# EAGLE schematic PM_sensor_breakout_v1 (EAGLE 6.4)
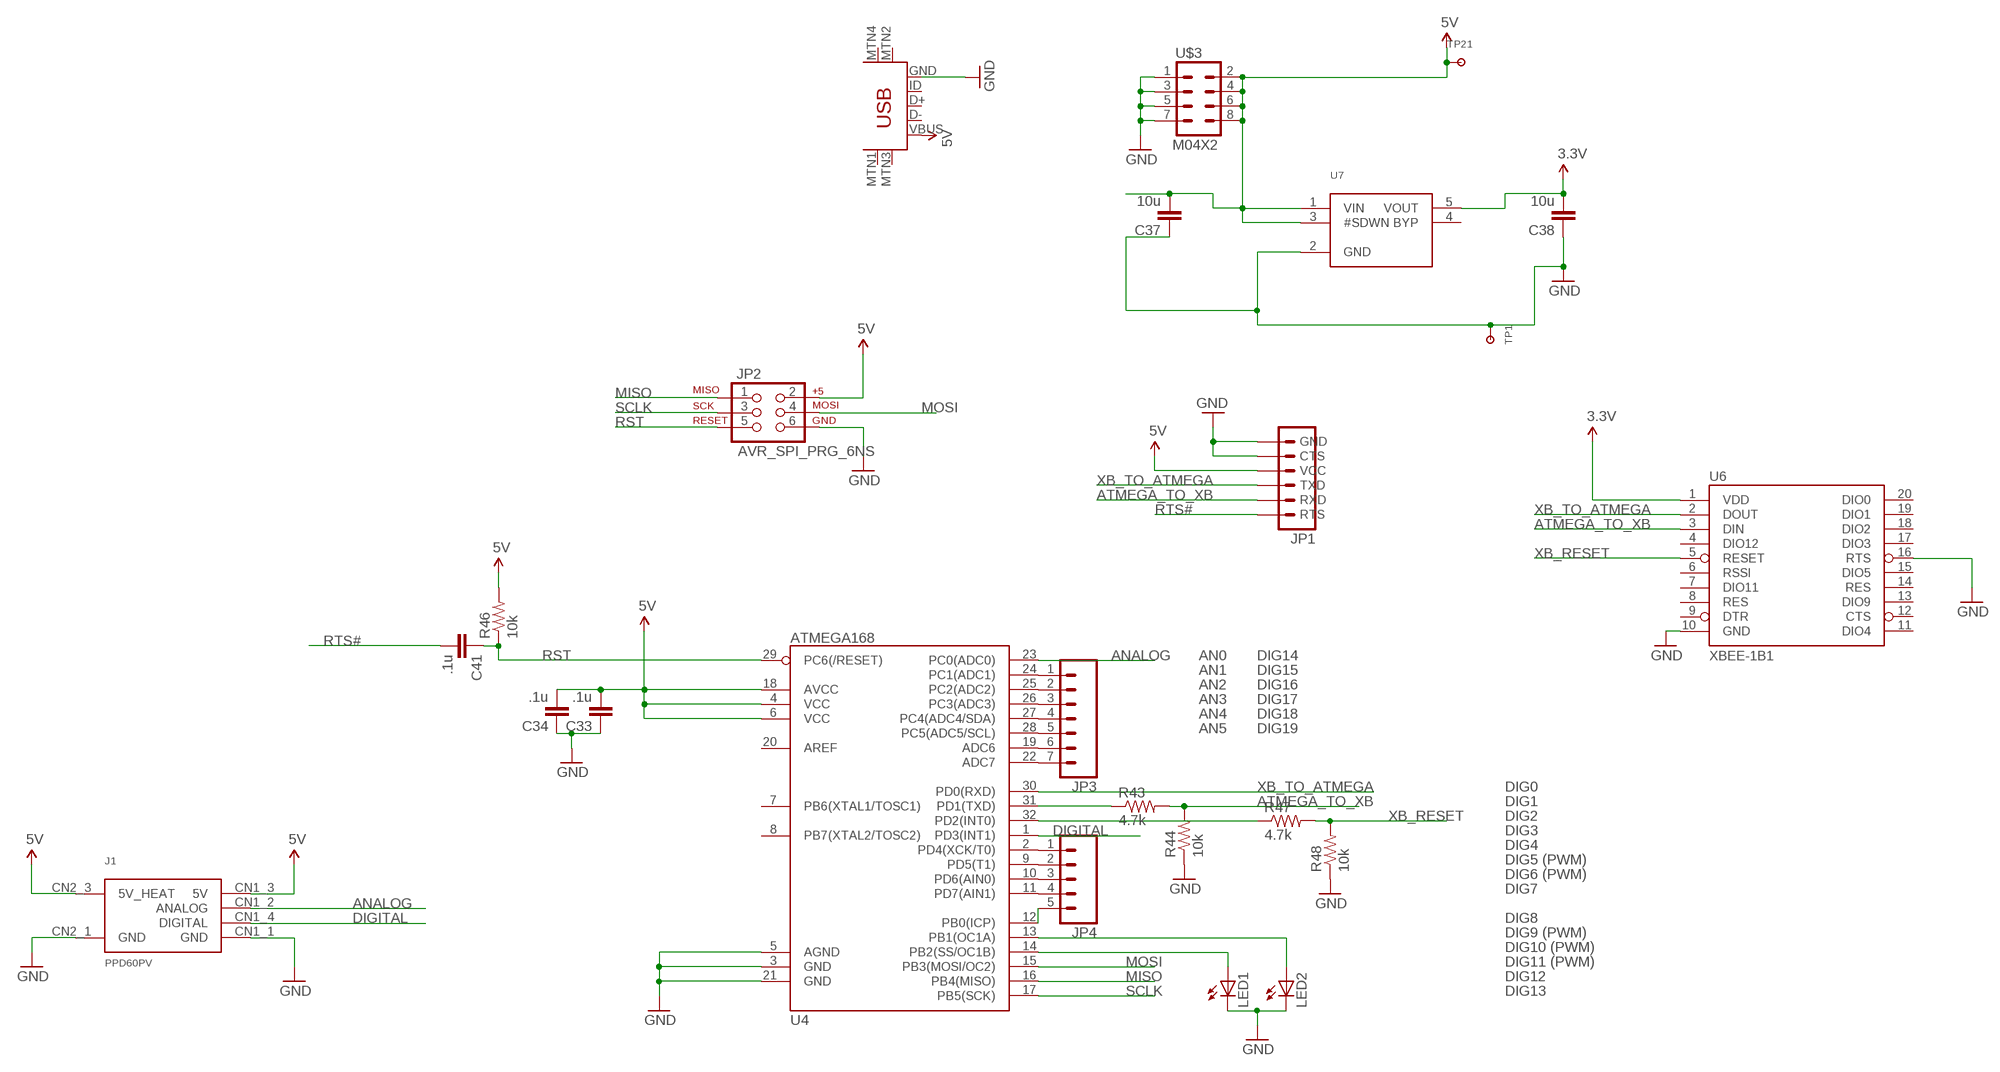
[diagram p0: schematic, sheet 1]

## Parts
C33  .1u  CAP0603  [0603]
C34  .1u  CAP0603  [0603]
C37  10u  CAP0603  [0603]
C38  10u  CAP0603  [0603]
C41  .1u  CAP0603  [0603]
J1  PPD60PV  [PPD60PV]
JP1  FTDI_CABLESIP  [1X06]
JP2  AVR_SPI_PRG_6NS  [2X3-NS]
JP3  M07  [1X07]
JP4  M05PTH  [1X05]
LED1  LEDCHIPLED_0805  [CHIPLED_0805]
LED2  LEDCHIPLED_0805  [CHIPLED_0805]
R43  4.7k  RESISTOR0603  [0603]
R44  10k  RESISTOR0603  [0603]
R46  10k  RESISTOR0603  [0603]
R47  4.7k  RESISTOR0603  [0603]
R48  10k  RESISTOR0603  [0603]
TP1  TESTPOINT100MIL  [TESTPOINT-100MIL]
TP21  TESTPOINT100MIL  [TESTPOINT-100MIL]
U4  ATMEGA168  [TQFP32-08]
U6  XBEE-1B1  [XBEE-1]
U7  LT1761-X  [TSOT23-5_LINEAR]
U$3  M04X2  [2X4]
U$4  USB-MINIB-5PIN  [USB-MINIB]

## Nets
3.3V [power]: C38.2 U6.1(VDD) U7.5(VOUT)
5V [power]: C33.2 C34.2 C37.2 J1.CN1_3(5V) J1.CN2_3(5V_HEAT) JP1.3(VCC) JP2.2 R46.2 TP21.2 U4.4(VCC) U4.6(VCC) U4.18(AVCC) U7.1(VIN) U7.3(#SDWN) U$3.2 U$3.4 U$3.6 U$3.8 U$4.VBUS
ANALOG: J1.CN1_2(ANALOG) U4.23(PC0(ADC0))
ATMEGA_TO_XB: JP1.5(RXD) R43.2 R44.2 U6.3(DIN)
DIGITAL: J1.CN1_4(DIGITAL) U4.1(PD3(INT1))
GND [power]: C33.1 C34.1 C37.1 C38.1 J1.CN1_1(GND) J1.CN2_1(GND) JP1.1(GND) JP1.2(CTS) JP2.6 LED1.C LED2.C R44.1 R48.1 TP1.2 U4.3(GND) U4.5(AGND) U4.21(GND) U6.10(GND) U6.16(RTS) U7.2(GND) U$3.1 U$3.3 U$3.5 U$3.7 U$4.GND
MISO: JP2.1 U4.16(PB4(MISO))
MOSI: JP2.4 U4.15(PB3(MOSI/OC2))
N$1: LED2.A U4.13(PB1(OC1A))
N$2: JP3.1 U4.24(PC1(ADC1))
N$3: LED1.A U4.14(PB2(SS/OC1B))
N$4: JP3.2 U4.25(PC2(ADC2))
N$5: JP3.3 U4.26(PC3(ADC3))
N$6: JP3.4 U4.27(PC4(ADC4/SDA))
N$7: JP3.5 U4.28(PC5(ADC5/SCL))
N$8: JP3.6 U4.19(ADC6)
N$9: JP3.7 U4.22(ADC7)
N$10: JP4.1 U4.2(PD4(XCK/T0))
N$11: JP4.2 U4.9(PD5(T1))
N$12: JP4.3 U4.10(PD6(AIN0))
N$13: JP4.4 U4.11(PD7(AIN1))
N$14: JP4.5 U4.12(PB0(ICP))
N$20: R43.1 U4.31(PD1(TXD))
N$22: R47.1 U4.32(PD2(INT0))
RST: C41.1 JP2.5 R46.1 U4.29(PC6(/RESET))
RTS#: C41.2 JP1.6(RTS)
SCLK: JP2.3 U4.17(PB5(SCK))
XB_RESET: R47.2 R48.2 U6.5(RESET)
XB_TO_ATMEGA: JP1.4(TXD) U4.30(PD0(RXD)) U6.2(DOUT)
Unconnected: U4.7(PB6(XTAL1/TOSC1)) U4.8(PB7(XTAL2/TOSC2)) U4.20(AREF) U6.4(DIO12) U6.6(RSSI) U6.7(DIO11) U6.8(RES) U6.9(DTR) U6.11(DIO4) U6.12(CTS) U6.13(DIO9) U6.14(RES) U6.15(DIO5) U6.17(DIO3) U6.18(DIO2) U6.19(DIO1) U6.20(DIO0) U7.4(BYP) U$4.D+ U$4.D- U$4.ID U$4.MTN1(MTN2) U$4.MTN2(MTN3) U$4.MTN3(MTN1) U$4.MTN4

## Notes on the sheet
- AN0 | DIG14
- AN1 | DIG15
- AN2 | DIG16
- AN3 | DIG17
- AN4 | DIG18
- AN5 | DIG19
- DIG0
- DIG1
- DIG2
- DIG3
- DIG4
- DIG5 (PWM)
- DIG6 (PWM)
- DIG7
- DIG8
- DIG9 (PWM)
- DIG10 (PWM)
- DIG11 (PWM)
- DIG12
- DIG13

## Library data of the parts
C33 C34 C37 C38 C41 = SparkFun:CAP: Capacitor Standard 0603 ceramic capacitor, and 0.1" leaded capacitor.
J1 = Cool_Electricity:PPD60PV
JP1 = custom:FTDI_CABLE: Header 6 Standard 6-pin 0.1" header. Use with straight break away headers (SKU : PRT-00116), right angle break away headers (PRT-00553), swiss pins (PRT-00743), machine pins (PRT-00117), and female headers (PRT-00115). Molex polarized connector foot print use with SKU : PRT-08094 with associated crimp pins and housings. NOTES ON THE VARIANTS LOCK and LOCK_LONGPADS... This footprint was designed to help hold the alignment of a through-hole component (i.e. 6-pin header) while soldering it into place. You may notice that each hole has been shifted either up or down by 0.005 of an inch from it's more standard position (which is a perfectly straight line). This slight alteration caused the pins (the squares in the middle) to touch the edges of the holes. Because they are alternating, it causes a "brace" to hold the component in place. 0.005 has proven to be the perfect amount of "off-center" position when using our standard breakaway headers. Although looks a little odd when you look at the bare footprint, once you have a header in there, the alteration is very hard to notice. Also, if you push a header all the way into place, it is covered up entirely on the bottom side. This idea of altering the position of holes to aid alignment will be further integrated into the Sparkfun Library for other footprints. It can help hold any component with 3 or more connection pins.
JP2 = SparkFun:AVR_SPI_PRG_6: AVR ISP 6 Pin This is the reduced ISP connector for AVR programming. Common on Arduino. This footprint will take up less PCB space and can be used with a 10-pin to 6-pin adapter such as SKU: BOB-08508
JP3 = SparkFun-Connectors:M07: Header 7 Standard 7-pin 0.1" header. Use with straight break away headers (SKU : PRT-00116), right angle break away headers (PRT-00553), swiss pins (PRT-00743), machine pins (PRT-00117), and female headers (PRT-00115). NOTES ON THE VARIANTS LOCK and LOCK_LONGPADS... This footprint was designed to help hold the alignment of a through-hole component (i.e. 7-pin header) while soldering it into place. You may notice that each hole has been shifted either up or down by 0.005 of an inch from it's more standard position (which is usually a perfectly straight line). This slight alteration caused the pins (the squares in the middle) to touch the edges of the holes. Because they are alternating, it causes a "brace" to hold the header in place. 0.005 has proven to be the perfect amount of "off-center" position when using our standard breakaway headers. Although looks a little odd when you look at the bare footprint, once you have a header in there, the alteration is very hard to notice. Also, if you push a header all the way into place, it is covered up entirely on the bottom side. This idea of altering the position of holes to aid alignment will be further integrated into the Sparkfun Library for other footprints. It can help hold any component with 3 or more connection pins.
JP4 = SparkFun-Connectors:M05: Header 5 Standard 5-pin 0.1" header. Use with straight break away headers (SKU : PRT-00116), right angle break away headers (PRT-00553), swiss pins (PRT-00743), machine pins (PRT-00117), and female headers (PRT-00115). Molex polarized connector foot print use with SKU : PRT-08230 with associated crimp pins and housings.
LED1 LED2 = led:LED: LED OSRAM: - CHIPLED LG R971, LG N971, LY N971, LG Q971, LY Q971, LO R971, LY R971 LH N974, LH R974 LS Q976, LO Q976, LY Q976 LO Q996 - Hyper CHIPLED LW Q18S LB Q993, LB Q99A, LB R99A - SideLED LS A670, LO A670, LY A670, LG A670, LP A670 LB A673, LV A673, LT A673, LW A673 LH A674 LY A675 LS A676, LA A676, LO A676, LY A676, LW A676 LS A679, LY A679, LG A679 - Hyper Micro SIDELED® LS Y876, LA Y876, LO Y876, LY Y876 LT Y87S - SmartLED LW L88C, LW L88S LB L89C, LB L89S, LG L890 LS L89K, LO L89K, LY L89K LS L896, LA L896, LO L896, LY L896 - TOPLED LS T670, LO T670, LY T670, LG T670, LP T670 LSG T670, LSP T670, LSY T670, LOP T670, LYG T670 LG T671, LOG T671, LSG T671 LB T673, LV T673, LT T673, LW T673 LH T674 LS T676, LA T676, LO T676, LY T676, LB T676, LH T676, LSB T676, LW T676 LB T67C, LV T67C, LT T67C, LS T67K, LO T67K, LY T67K, LW E67C LS E67B, LA E67B, LO E67B, LY E67B, LB E67C, LV E67C, LT E67C LW T67C LS T679, LY T679, LG T679 LS T770, LO T770, LY T770, LG T770, LP T770 LB T773, LV T773, LT T773, LW T773 LH T774 LS E675, LA E675, LY E675, LS T675 LS T776, LA T776, LO T776, LY T776, LB T776 LHGB T686 LT T68C, LB T68C - Hyper Mini TOPLED® LB M676 - Mini TOPLED Santana® LG M470 LS M47K, LO M47K, LY M47K Source: http://www.osram.convergy.de LUXEON: - LUMILED® LXK2-PW12-R00, LXK2-PW12-S00, LXK2-PW14-U00, LXK2-PW14-V00 LXK2-PM12-R00, LXK2-PM12-S00, LXK2-PM14-U00 LXK2-PE12-Q00, LXK2-PE12-R00, LXK2-PE12-S00, LXK2-PE14-T00, LXK2-PE14-U00 LXK2-PB12-K00, LXK2-PB12-L00, LXK2-PB12-M00, LXK2-PB14-N00, LXK2-PB14-P00, LXK2-PB14-Q00 LXK2-PR12-L00, LXK2-PR12-M00, LXK2-PR14-Q00, LXK2-PR14-R00 LXK2-PD12-Q00, LXK2-PD12-R00, LXK2-PD12-S00 LXK2-PH12-R00, LXK2-PH12-S00 LXK2-PL12-P00, LXK2-PL12-Q00, LXK2-PL12-R00 Source: www.luxeon.com KINGBRIGHT: KA-3528ASYC Source: www.kingbright.com
R43 R44 R46-R48 = SparkFun:RESISTOR: Resistor Basic schematic elements and footprints for 0603, 1206, and PTH 1/10th watt (small) resistors.
TP1 TP21 = WSNlib:TESTPOINT: Generic Testpoint
U4 = SparkFun:ATMEGA168
U6 = SparkFun:XBEE-1
U7 = Cool_Electricity:LT1761-X: LT1761-X LDO Voltage Regulator
U$3 = SparkFun-Connectors:M04X2: .1" header, two rows of four.
U$4 = SparkFun-Connectors:USB-MINIB: Mini-USB "B" connector with 5th pin broken out. Created new symbol breaking out 5th "ID" pin in mini/micro USB connector spec. See: http://en.wikipedia.org/wiki/Mini_usb#Cables. Uses same footprint as 4-pin symbol. Also added pins to connect to mounting / shield pads if required (probably not generally needed as signals aren't shielded once they leave the connector).

## Net classes
0 default: width 0.254 mm, drill 0.381 mm, clearance 0.254 mm
1 power: width 0.381 mm, drill 0.381 mm, clearance 0.254 mm